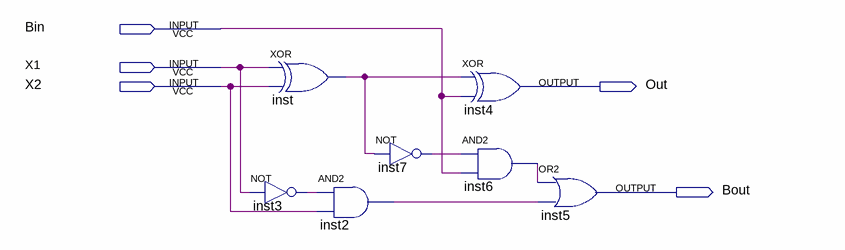
[diagram p0: schematic sheet]
// Quartus schematic Subtrator.bdf as structural Verilog: 7 symbols, 5 pins
module Subtrator (
  input  Bin,
  input  X1,
  input  X2,
  output Out,
  output Bout
);

  wire inst2_out, inst3_out, inst6_out, inst7_out, inst_out;

  xor inst (inst_out, X1, X2);
  not inst3 (inst3_out, X1);
  not inst7 (inst7_out, inst_out);
  and inst2 (inst2_out, inst3_out, X2);
  xor inst4 (Out, inst_out, Bin);
  and inst6 (inst6_out, inst7_out, Bin);
  or inst5 (Bout, inst6_out, inst2_out);
endmodule
